# EAGLE design Sensors-V1 (EAGLE 9.6.2)
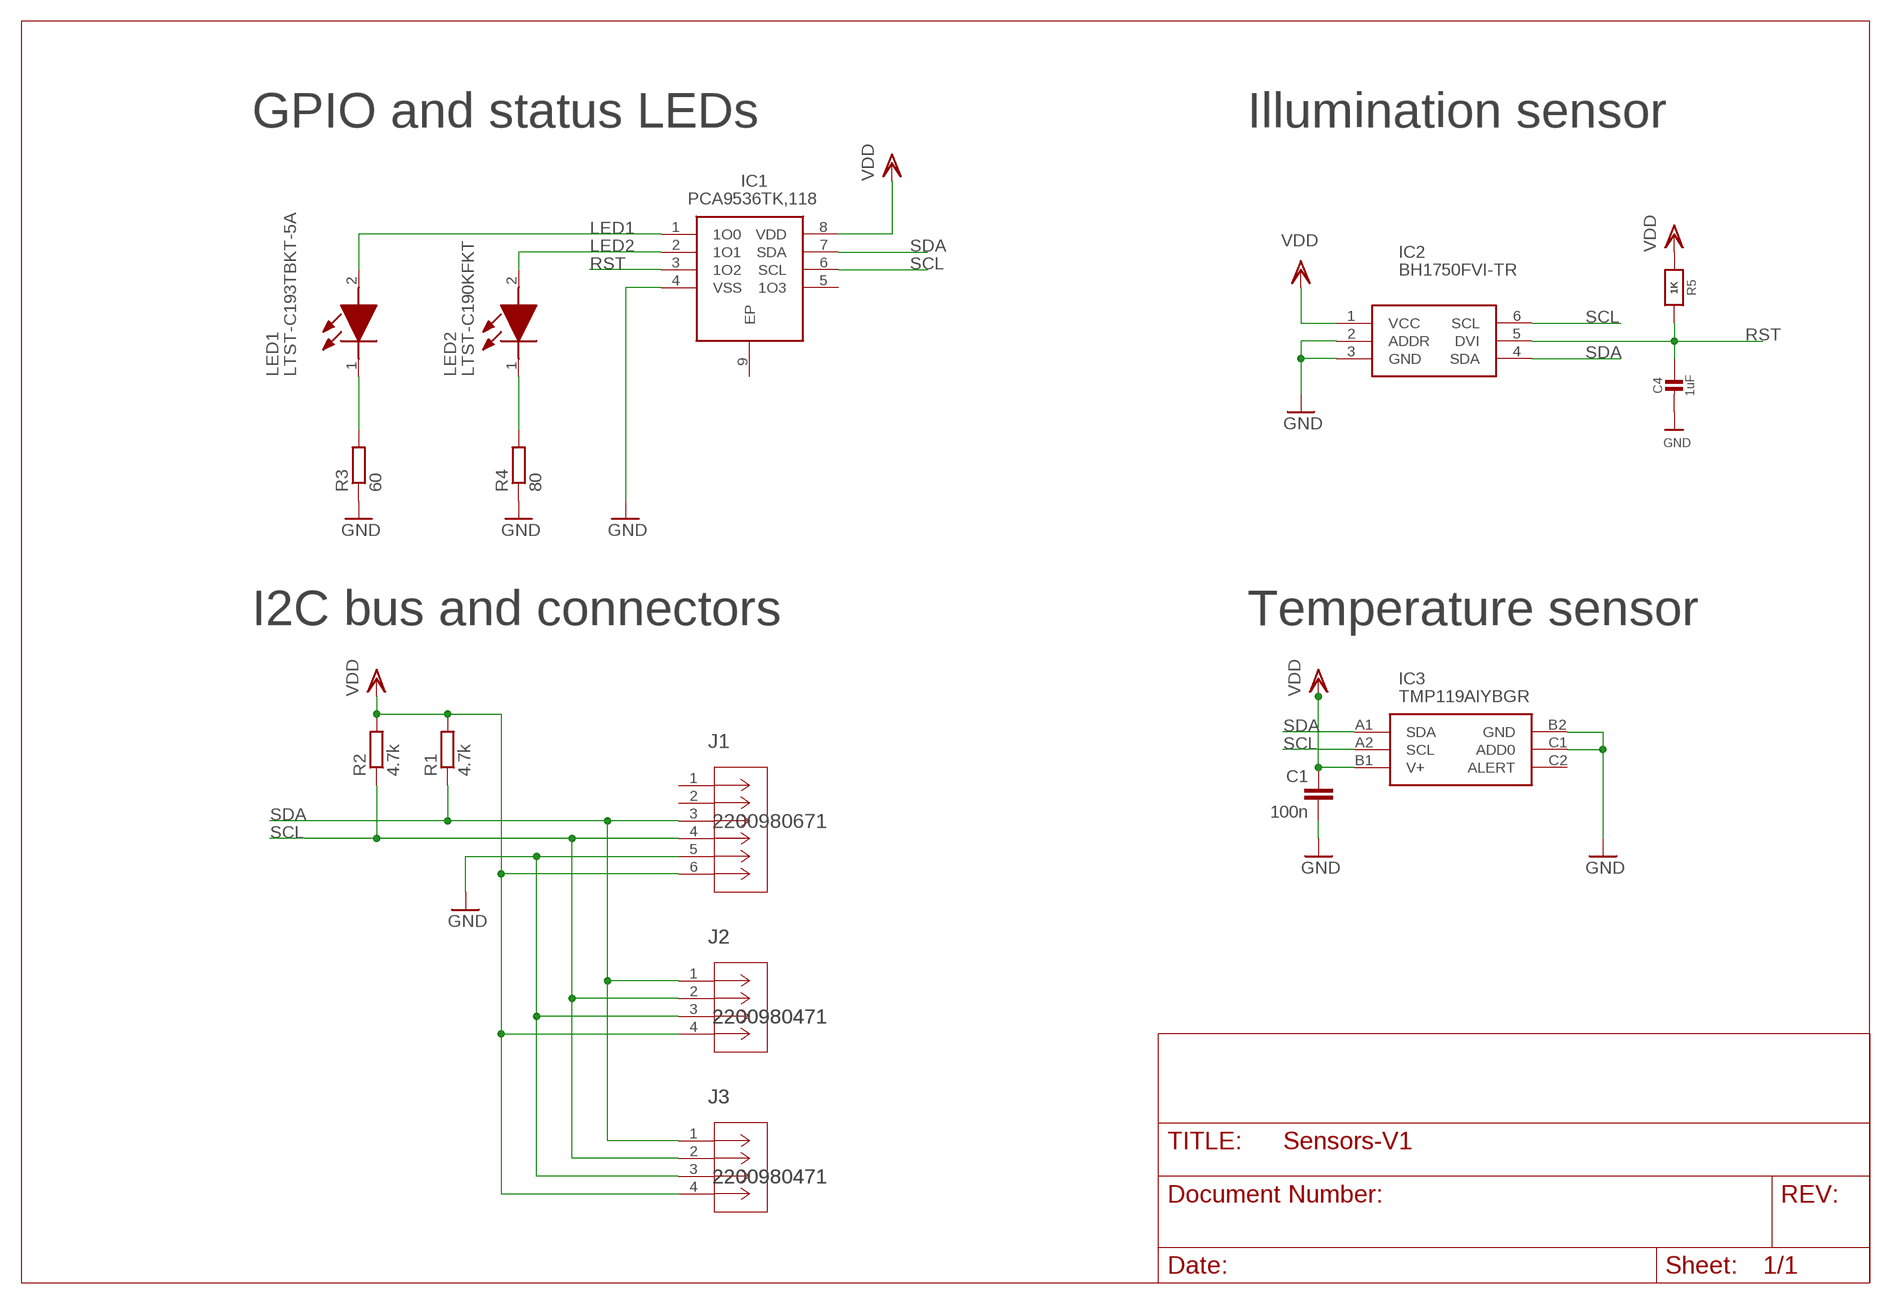
[diagram p0: schematic, sheet 1]

## Parts
C1  100n  C-EUC0603  [C0603]
C4  1uF  CAP_CERAMIC0603_NO  [0603-NO]
IC1  PCA9536TK,118  [SON50P300X300X100-9N]
IC2  BH1750FVI-TR  [WSOF6]
IC3  TMP119AIYBGR  [BGA6C40P2X3_95X149X52]
J1  2200980671  [CONN_2200980000-SD_06_MOL]
J2  2200980471  [CONN_2200980000-SD_04_MOL]
J3  2200980471  [CONN_2200980000-SD_04_MOL]
LED1  LTST-C193TBKT-5A  [LEDC1608X45N]
LED2  LTST-C190KFKT  [LEDC1607X80N]
R1  4.7k  R_JLMR0603  [R0603]
R2  4.7k  R_JLMR0603  [R0603]
R3  60  R_JLMR0603  [R0603]
R4  80  R_JLMR0603  [R0603]
R5  1K  RESISTOR_0603_NOOUT  [0603-NO]

## Nets
GND: C1.2 C4.2 IC1.4(VSS) IC2.2(ADDR) IC2.3(GND) IC3.B2(GND) IC3.C1(ADD0) J1.5 J2.3 J3.3 R3.1 R4.1
LED1: IC1.1(1O0) LED1.2(A)
LED2: IC1.2(1O1) LED2.2(A)
N$1: LED1.1(K) R3.2
N$2: LED2.1(K) R4.2
RST: C4.1 IC1.3(1O2) IC2.5(DVI) R5.2
SCL: IC1.6(SCL) IC2.6(SCL) IC3.A2(SCL) J1.4 J2.2 J3.2 R2.1
SDA: IC1.7(SDA) IC2.4(SDA) IC3.A1(SDA) J1.3 J2.1 J3.1 R1.1
VDD: C1.1 IC1.8(VDD) IC2.1(VCC) IC3.B1(V+) J1.6 J2.4 J3.4 R1.2 R2.2 R5.1
Unconnected: IC1.5(1O3) IC1.9(EP) IC3.C2(ALERT) J1.1 J1.2

## Notes on the sheet
- GPIO and status LEDs | Illumination sensor
- I2C bus and connectors | Temperature sensor

## Library data of the parts
C1 = jlm_cap:C-EU: CAPACITOR, European symbol
C4 = microbuilder:CAP_CERAMIC: Ceramic Capacitors For new designs, use the packages preceded by an '_' character since they are more reliable: The following footprints should be used on most boards: _0402 - Standard footprint for regular board layouts _0603 - Standard footprint for regular board layouts _0805 - Standard footprint for regular board layouts _1206 - Standard footprint for regular board layouts For extremely tight-pitch boards where space is at a premium, the following 'micro-pitch' footprints can be used (smaller pads, no silkscreen outline, etc.): _0402MP - Micro-pitch footprint for very dense/compact boards _0603MP - Micro-pitch footprint for very dense/compact boards _0805MP - Micro-pitch footprint for very dense/compact boards _1206MP - Micro-pitch footprint for very dense/compact boards
IC1 = teensyamp:PCA9536TK,118: NXP - PCA9536TK,118 - I/O EXPANDER, 4BIT, 400KHZ, HVSON-8 Source: Datasheet <http://www.nxp.com/docs/en/data-sheet/PCA9536.pdf>; DESCRIPTION: NXP - PCA9536TK,118 - I/O EXPANDER, 4BIT, 400KHZ, HVSON-8; HEIGHT: 1mm; MANUFACTURER_NAME: NXP; MANUFACTURER_PART_NUMBER: PCA9536TK,118
IC2 = teensyamp:BH1750FVI-TR: Ambient Light Sensor,16bit,I2C,WSOF6I ROHM BH1750FVI-TR Ambient Light Sensor Unit Surface Mount Source: Datasheet <https://componentsearchengine.com/Datasheets/2/BH1750FVI-TR.pdf>; DESCRIPTION: Ambient Light Sensor,16bit,I2C,WSOF6I ROHM BH1750FVI-TR Ambient Light Sensor Unit Surface Mount; HEIGHT: mm; MANUFACTURER_NAME: ROHM Semiconductor; MANUFACTURER_PART_NUMBER: BH1750FVI-TR
IC3 = teensyamp:TMP119AIYBGR: Board Mount Temperature Sensors TEMPERATURE SENSOR Source: Datasheet <https://www.ti.com/lit/ds/symlink/tmp119.pdf?ts=1711471230059&ref_url=https%3A%2F%2Fwww.ti.com%2Fsitesearch%2Fen-us%2Fdocs%2Funiversalsearch.tsp%3FlangPref%3Den-US%26searchTerm%3Dtmp119%26nr%3D70>; DESCRIPTION: Board Mount Temperature Sensors TEMPERATURE SENSOR; HEIGHT: 0.525mm; MANUFACTURER_NAME: Texas Instruments; MANUFACTURER_PART_NUMBER: TMP119AIYBGR; MOUSER_PART_NUMBER: 595-TMP119AIYBGR; MOUSER_PRICE-STOCK: https://www.mouser.co.uk/ProductDetail/Texas-Instruments/TMP119AIYBGR?qs=dbcCsuKDzFUz%2FSabBerKMA%3D%3D
J1 = teensyamp:2200980671: molex micro-lock plus horizontal header 6 pins through hole; COPYRIGHT: Copyright (C) 2025 Ultra Librarian. All rights reserved.; MANUFACTURER_PART_NUMBER: 2200980671; MFR_NAME: Molex Connector Corporation
J2 J3 = teensyamp:2200980471: molex micro-lock plus hoizintal header 4 pins through hole; COPYRIGHT: Copyright (C) 2025 Ultra Librarian. All rights reserved.; MANUFACTURER_PART_NUMBER: 2200970471; MFR_NAME: Molex Connector Corporation
LED1 = teensyamp:LTST-C193TBKT-5A: Standard LEDs - SMD Blue 470nm 28mcd 20mA Source: Datasheet <https://componentsearchengine.com/Datasheets/1/LTST-C193TBKT-5A.pdf>; DESCRIPTION: Standard LEDs - SMD Blue 470nm 28mcd 20mA; HEIGHT: 0.45mm; MANUFACTURER_NAME: Lite-On; MANUFACTURER_PART_NUMBER: LTST-C193TBKT-5A; MOUSER_PART_NUMBER: 859-LTSTC193TBKT5A; MOUSER_PRICE-STOCK: https://www.mouser.co.uk/ProductDetail/Lite-On/LTST-C193TBKT-5A?qs=xIkB7y1OTorvzzuuxuVkOA%3D%3D
LED2 = teensyamp:LTST-C190KFKT: LED,SMD,0603,Orange,60mcd,130deg Lite-On LTST-C190KFKT Orange LED, 605 nm, 1608 (0603), Rectangle Lens SMD Package Source: Datasheet <https://datasheet.datasheetarchive.com/originals/distributors/Datasheets-305/79294.pdf>; DESCRIPTION: LED,SMD,0603,Orange,60mcd,130deg Lite-On LTST-C190KFKT Orange LED, 605 nm, 1608 (0603), Rectangle Lens SMD Package; HEIGHT: 0.8mm; MANUFACTURER_NAME: Lite-On; MANUFACTURER_PART_NUMBER: LTST-C190KFKT; MOUSER_PART_NUMBER: 859-LTST-C190KFKT; MOUSER_PRICE-STOCK: https://www.mouser.co.uk/ProductDetail/LITEON/LTST-C190KFKT?qs=6QHXI9jVcTyVErVIqD1vhg%3D%3D
R1-R4 = jlm_resistors:R_JLM: RESISTOR, European symbol
R5 = microbuilder:RESISTOR: Resistors For new designs, use the packages preceded by an '_' character since they are more reliable: The following footprints should be used on most boards: _0402 - Standard footprint for regular board layouts _0603 - Standard footprint for regular board layouts _0805 - Standard footprint for regular board layouts _1206 - Standard footprint for regular board layouts For extremely tight-pitch boards where space is at a premium, the following 'micro-pitch' footprints can be used (smaller pads, no silkscreen outline, etc.): _0402MP - Micro-pitch footprint for very dense/compact boards _0603MP - Micro-pitch footprint for very dense/compact boards _0805MP - Micro-pitch footprint for very dense/compact boards _1206MP - Micro-pitch footprint for very dense/compact boards

## Net classes
1 highpower: width 0.406 mm, drill 0.483 mm
2 lowpower: width 0.305 mm, drill 0.483 mm

## Board
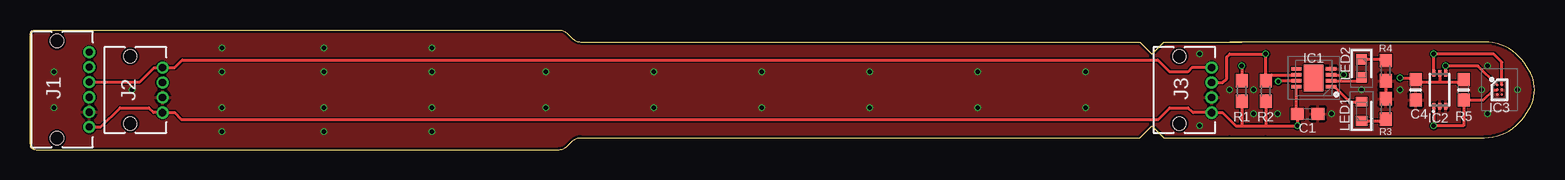
[diagram p1: board, top side]
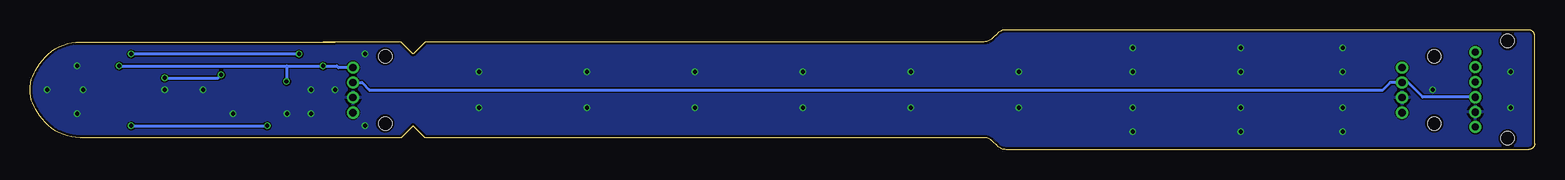
[diagram p2: board, bottom side, seen from below]

Size 125.43 x 10 mm. Coordinates in mm from the lower left corner, seen from the top.
Outline: 100,1 103,1
Outline: 103,1 121.24,1 arc57 124.6,2.83 124.95,3.37 arc66 124.95,6.63 124.6,7.17 arc57 121.24,9 101,9
Outline: 101,9 100,9
Outline: 101,9 94.5,9 93.5,8 92.5,9 45.91,9 arc-45 45.21,9.29 44.79,9.71 arc45 44.09,10 0.5,10 arc90 0,9.5 0,0.5 arc90 0.5,0 44.09,0 arc45 44.79,0.29 45.21,0.71 arc-45 45.91,1 92.5,1 93.5,2 94.5,1 103,1
Copper layers (1*16): Top 0.018mm / dielectric 1.55mm / Bottom 0.018mm
Design rules "Multi-CB_2L_100цm-Tracks_OL35цm *": minimum track width 0.1mm, minimum drill 0.2mm, track to track 0.1mm, track to pad 0.1mm, pad to pad 0.1mm, via to via 0.1mm, smd to smd 0mil, copper to edge 0.2mm, drill to drill 0.2mm, minimum pad ring 0.125mm, minimum via ring 0.1mm, stop-mask expansion 2mil, vias tented up to drill 0mil, thermal gap 0.2mm

### Footprints (pad centres in the part's own frame; a part is rotated, then mirrored left to right if it is on the bottom)
C0603 = smd 1.1 x 1: 1 -0.85,0; 2 0.85,0
0603-NO = smd 1.075 x 1: 1 -0.85,0; 2 0.85,0
SON50P300X300X100-9N = smd 0.85 x 0.3: 1 -1.45,0.75; 2 -1.45,0.25; 3 -1.45,-0.25; 4 -1.45,-0.75; 5 1.45,-0.75; 6 1.45,-0.25; 7 1.45,0.25; 8 1.45,0.75 | smd 1.65 x 2.25: 9 0,0
WSOF6 = smd 0.55 x 0.25: 1 -1.375,0.5; 2 -1.375,0; 3 -1.375,-0.5; 4 1.375,-0.5; 5 1.375,0; 6 1.375,0.5
BGA6C40P2X3_95X149X52 = smd 0.2 x 0.2: A1 -0.2,0.4; A2 0.2,0.4; B1 -0.2,0; B2 0.2,0; C1 -0.2,-0.4; C2 0.2,-0.4
CONN_2200980000-SD_06_MOL = drill 0.61 pad 1.016: 1 0,0; 2 1.245,0; 3 2.489,0; 4 3.759,0; 5 5.004,0; 6 6.248,0 | hole 1.092: 7.188,-2.692; -0.94,-2.692
CONN_2200980000-SD_04_MOL = drill 0.61 pad 1.016: 1 0,0; 2 1.245,0; 3 2.489,0; 4 3.759,0 | hole 1.092: -0.94,-2.692; 4.674,-2.692
LEDC1608X45N = smd 0.8 x 0.95: 1 -0.8,0; 2 0.8,0
LEDC1607X80N = smd 0.9 x 0.85: 1 -0.75,0; 2 0.75,0
R0603 = smd 1.1 x 1: 1 -0.85,0; 2 0.85,0

### Placement (x,y rotation side)
C1  106.5,3 0 top
C4  115.5,5 270 top
IC1  107,6 180 top
IC2  117.5,5 90 top
IC3  122.5,5 0 top
J1  4.94,8.14 270 top
J2  11.05,6.85 270 top
J3  98.5,6.85 270 top
LED1  111,3.2 90 top
LED2  111,6.8 270 top
R1  101,4.9 270 top
R2  103,4.9 270 top
R3  113,3.4 270 top
R4  113,6.6 90 top
R5  119.5,5 90 top

### Tracks (layer width: path | path; a pad name or v marks a point on that pad's centre or on a via)
GND  (via drill 0.35)
  Top 0.254: R4.1 R3.1
  other vias: 124,5 79,6.5 79,3.5 43,6.5 43,3.5 16,6.5 16,3.5 33.5,6.5 33.5,3.5 52,6.5 52,3.5 70,6.5 70,3.5 61,6.5 61,3.5 24.5,6.5 24.5,3.5 16,8.5 24.5,8.5 33.5,8.5 33.5,1.5 24.5,1.5 16,1.5 88,6.5 88,3.5 121,5 114.2,5 111,5 108.5,3 100,5 102,5 104,3 102,3 97.5,2 97.5,8 121.5,7 121.5,3 2,6.5 2,3.5 8.5,5
  pour Top: 44.5,0 0,0 0,10 44.5,10 45.5,9 123,9 127,5 123,1 45.5,1
  pour Bottom: 44.5,0 0,0 0,10 44.5,10 45.5,9 123,9 127,5 123,1 45.5,1
LED1
  Top 0.254: IC1.1 108.75,5.25 110,4 LED1.2
LED2
  Top 0.254: IC1.2 109.29,5.75 110.7,5.75 LED2.2
N$1
  Top 0.254: LED1.1 112.85,2.4 R3.2
N$2
  Top 0.254: LED2.1 112.9,7.55 R4.2
RST  (via drill 0.35)
  Top 0.254: R5.2 119.3,5.65 117.5,5.65 | IC1.3 v109.5,6.25 | v114.2,6 115.35,6 C4.1 115.7,5.65 117.5,5.65 | IC2.5 117.5,5.65
  Bottom 0.254: v114.2,6 109.75,6 v109.5,6.25
SCL  (via drill 0.35)
  Top 0.254: IC1.6 103.5,6.25 R2.1 v103,8 100,8 99.75,7.75 99.75,5.9 99.45,5.61 J3.2 | IC2.6 v117,8 122,8 122.7,7.3 IC3.A2
  Bottom 0.254: J1.4 9.32,4.38 10.55,5.61 J2.2 12.05,5.61 12.65,5 97.15,5 97.75,5.61 J3.2 | v103,8 v117,8
SDA  (via drill 0.35)
  Top 0.254: J3.1 96.85,6.85 96.5,6.5 95,6.5 94,7.5 12.7,7.5 12.05,6.85 J2.1 10.35,6.85 9.15,5.65 J1.3 | IC1.7 104.1,5.75 v104.05,5.7 | v101,7 R1.1 | IC2.4 v118,7 120.7,7 IC3.A1
  Bottom 0.254: J3.1 99.7,6.85 99.85,7 v101,7 104,7 | v118,7 104,7 | 104,7 104.05,6.95 v104.05,5.7
VDD  (via drill 0.35)
  Top 0.254: J1.6 5.89,1.89 7.5,3.5 9.9,3.5 10.3,3.1 J2.4 12.05,3.09 12.64,2.5 94,2.5 95,3.5 96.54,3.5 96.95,3.09 J3.4 99.41,3.09 100.5,2 101,2 | 101,2 103,2 | 103,2 v105.65,2 C1.1 105.55,3.1 IC1.8 | R2.2 103,2 | R1.2 101,2 | IC2.1 v117,2 119.5,2 R5.1 121.15,4.15 122,5 IC3.B1
  Bottom 0.254: v117,2 v105.65,2